# Altium schematic sheet Sheet1.SchDoc
size A2; SheetNumber: 1; SheetTotal: 1
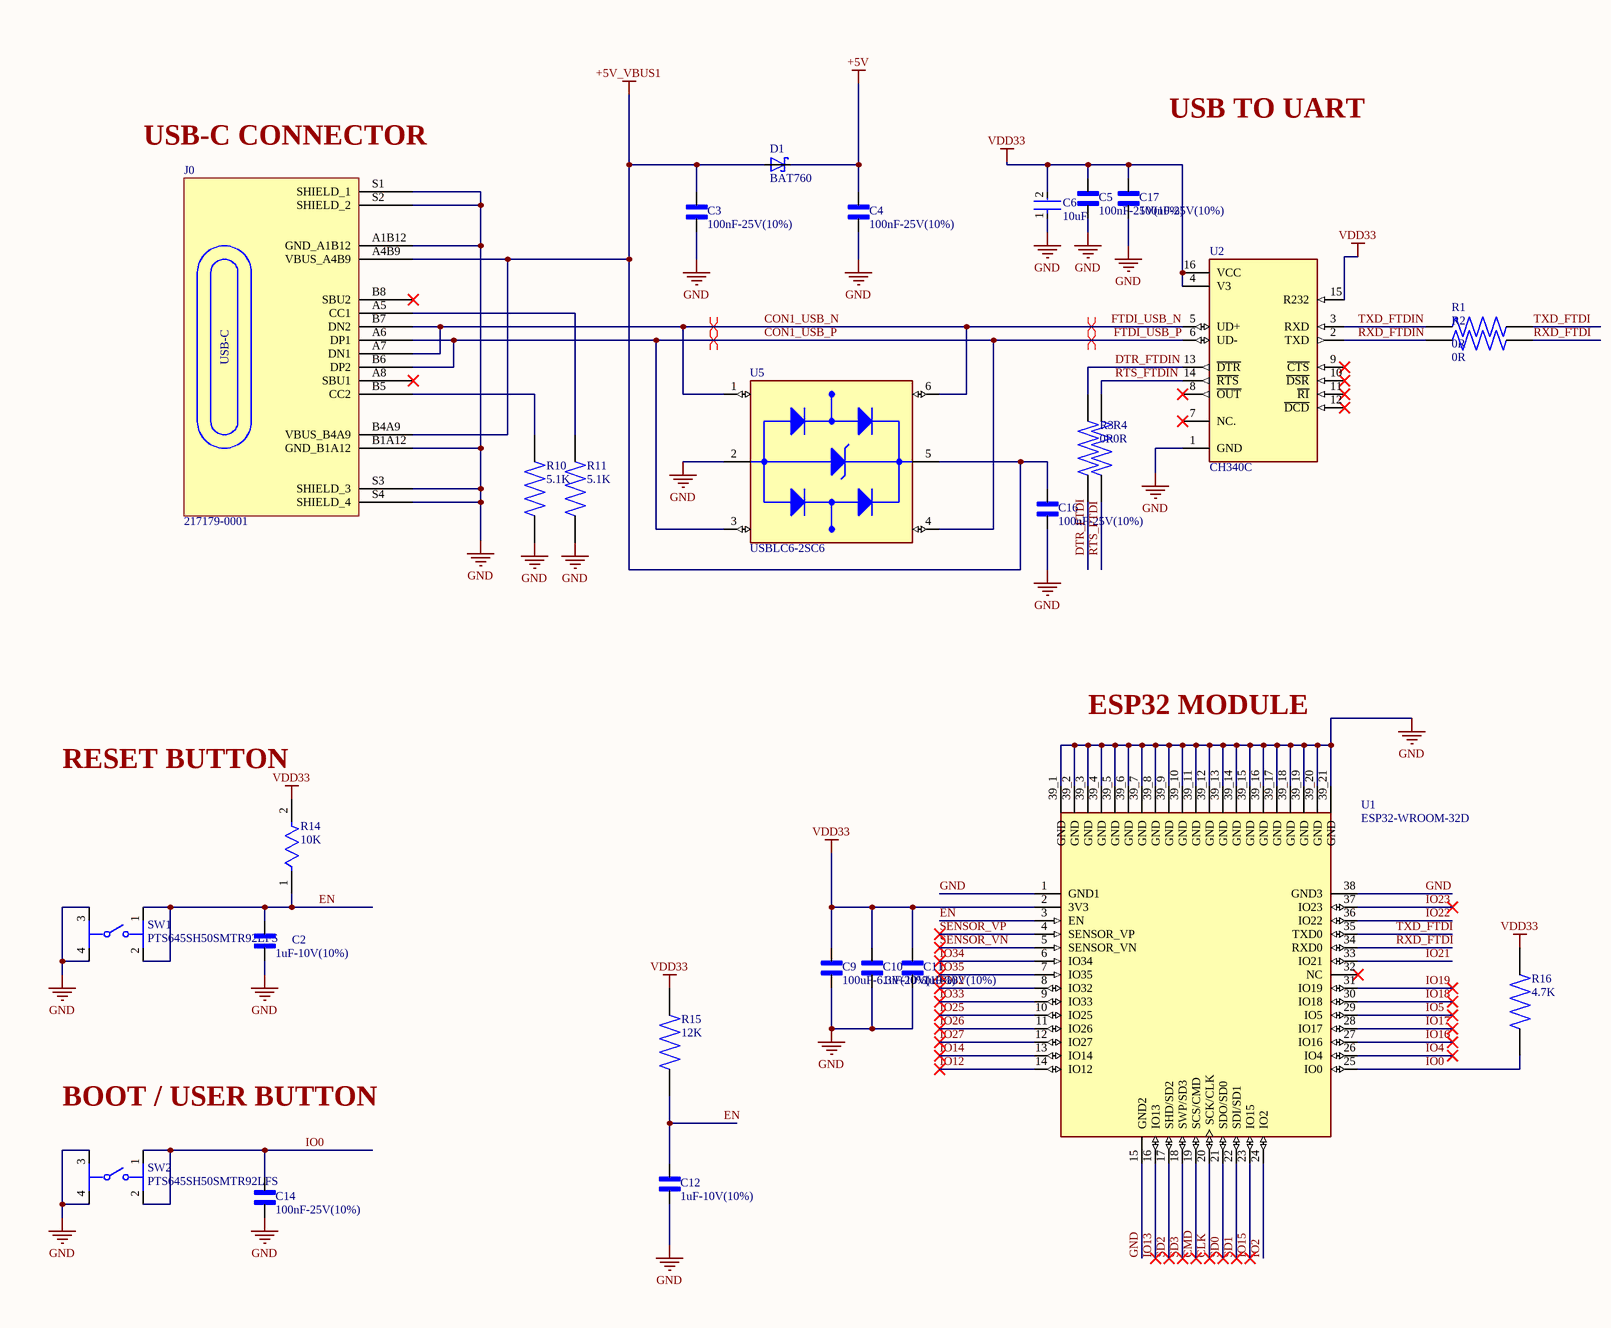
[diagram p0: Sheet1.SchDoc, left]
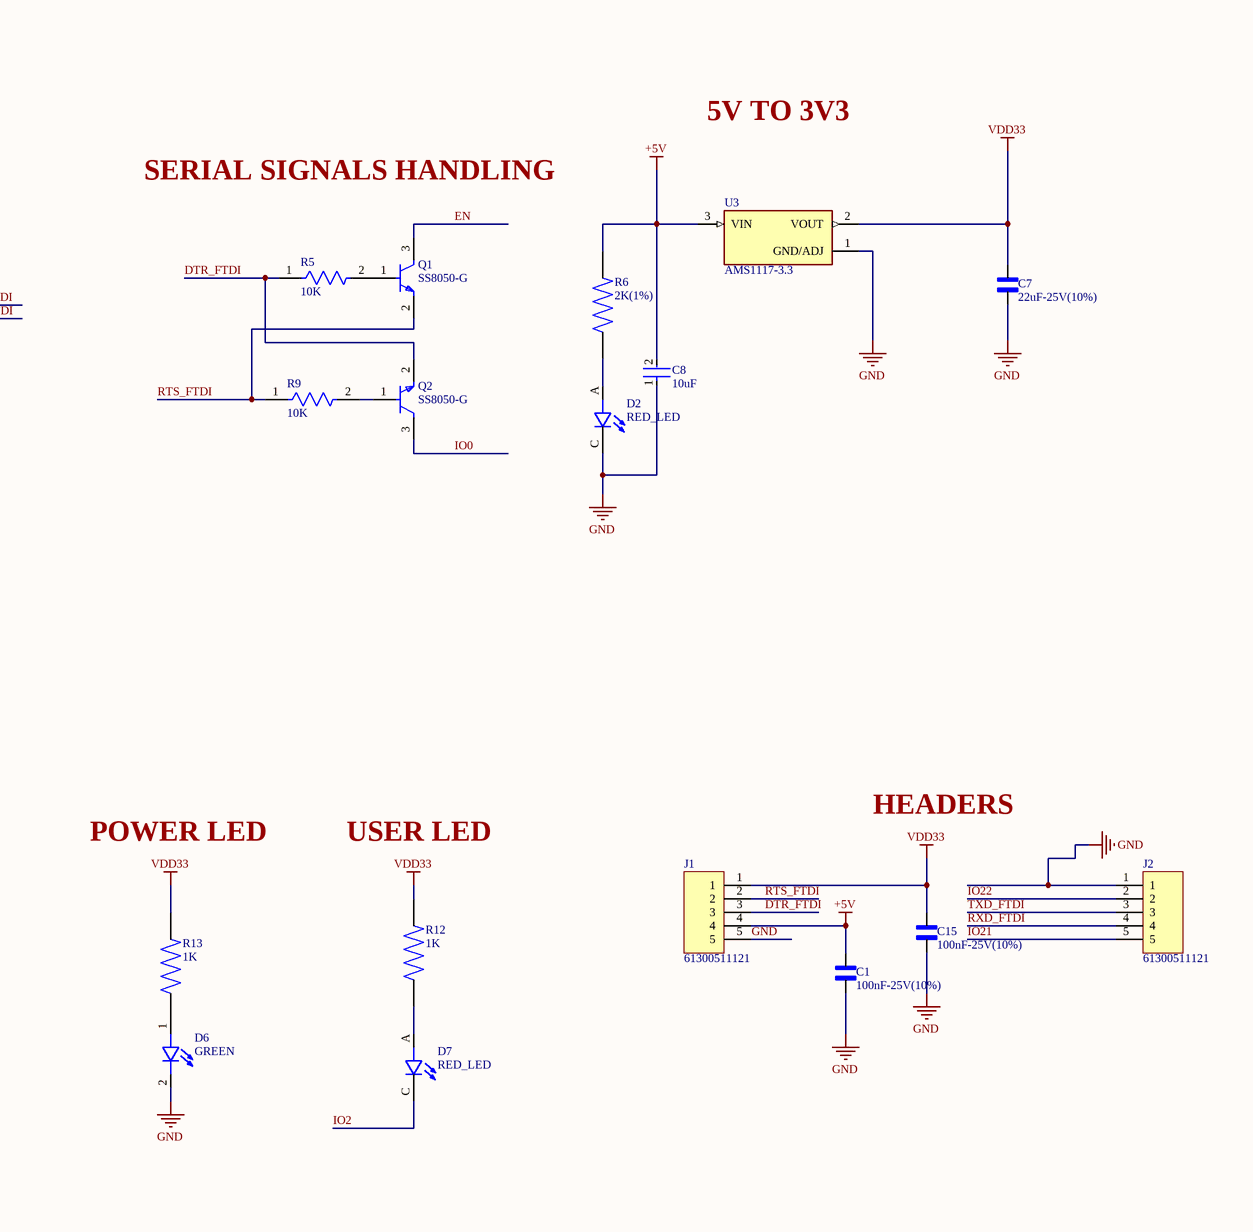
[diagram p1: Sheet1.SchDoc, right]

## Parts
C1  100nF-25V(10%)  [CAPC2012X145N - duplicate]
C2  1uF-10V(10%)  [CAPC2012X145N - duplicate]
C3  100nF-25V(10%)  [CAPC2012X145N - duplicate]
C4  100nF-25V(10%)  [CAPC2012X145N - duplicate]
C5  100nF-25V(10%)  [CAPC2012X145N - duplicate]
C6  10uF  [CAPC2012X145N - duplicate]
C7  22uF-25V(10%)  [CAPC2012X145N - duplicate]
C8  10uF  [CAPC2012X145N - duplicate]
C9  100uF-6.3V(20%)  [CAPC2012X145N - duplicate]
C10  1uF-10V(10%)  [CAPC2012X145N - duplicate]
C11  1uF-10V(10%)  [CAPC2012X145N - duplicate]
C12  1uF-10V(10%)  [CAPC2012X145N - duplicate]
C14  100nF-25V(10%)  [CAPC2012X145N - duplicate]
C15  100nF-25V(10%)  [CAPC2012X145N - duplicate]
C16  100nF-25V(10%)  [CAPC2012X145N - duplicate]
C17  100nF-25V(10%)  [CAPC2012X145N - duplicate]
D1  BAT760  [SOD323(F)]
D2  RED_LED  [LEDSC125X200X90-2N]
D6  GREEN  [LED_XZMG54W-1]
D7  RED_LED  [LEDSC125X200X90-2N]
J0  217179-0001  [FP-2171790001-MFG]
J1  61300511121  [HDR_1x5_2.54MM]
J2  61300511121  [HDR_1x5_2.54MM]
Q1  SS8050-G  [FP-SS8050-G-IPC_B]
Q2  SS8050-G  [FP-SS8050-G-IPC_B]
R1  0R  [RES_ERA6AED512V]
R2  0R  [RES_ERA6AED512V]
R3  0R  [RES_ERA6AED512V]
R4  0R  [RES_ERA6AED512V]
R5  10K  [RES_ERA6AED512V]
R6  2K(1%)  [RES_ERA6AED512V]
R9  10K  [RES_ERA6AED512V]
R10  5.1K  [RES_ERA6AED512V]
R11  5.1K  [RES_ERA6AED512V]
R12  1K  [RES_ERA6AED512V]
R13  1K  [RES_ERA6AED512V]
R14  10K  [RES_ERA6AED512V]
R15  12K  [RES_ERA6AED512V]
R16  4.7K  [RES_ERA6AED512V]
SW1  PTS645SH50SMTR92LFS  [FP-PTS645SH50SMTR92LFS-MFG]
SW2  PTS645SH50SMTR92LFS  [FP-PTS645SH50SMTR92LFS-MFG]
U1  ESP32-WROOM-32D  [MODULE_ESP32-WROOM-32D]
U2  CH340C  [SOIC127P600X180-16N]
U3  AMS1117-3.3  [SOT229P700X180-4N]
U5  USBLC6-2SC6  [SOT95P280X145-6N]

## Nets
+5V: C1.2 C4.1 C8.2 D1.1(K) J1.4 R6.2 U3.3(VIN)
+5V_VBUS1: C3.1 C16.2 D1.2(A) J0.A4B9(VBUS_A4B9) J0.B4A9(VBUS_B4A9) U5.5(VBUS)
GND: C1.1 C2.1 C3.2 C4.2 C5.1 C6.1 C7.1 C8.1 C9.1 C10.1 C11.1 C12.1 C14.1 C15.1 C16.1 C17.1 D2.C D6.2(C) J0.A1B12(GND_A1B12) J0.B1A12(GND_B1A12) J0.S1(SHIELD_1) J0.S2(SHIELD_2) J0.S3(SHIELD_3) J0.S4(SHIELD_4) J1.5 J2.1 R10.1 R11.1 SW1.3 SW1.4 SW2.3 SW2.4 U1.1(GND1) U1.15(GND2) U1.38(GND3) U1.39_1(GND) U1.39_2(GND) U1.39_3(GND) U1.39_4(GND) U1.39_5(GND) U1.39_6(GND) U1.39_7(GND) U1.39_8(GND) U1.39_9(GND) U1.39_10(GND) U1.39_11(GND) U1.39_12(GND) U1.39_13(GND) U1.39_14(GND) U1.39_15(GND) U1.39_16(GND) U1.39_17(GND) U1.39_18(GND) U1.39_19(GND) U1.39_20(GND) U1.39_21(GND) U2.1(GND) U3.1(GND/ADJ) U5.2(GND)
VDD33: C5.2 C6.2 C7.2 C9.2 C10.2 C11.2 C15.2 C17.2 J1.1 R12.2 R13.2 R14.2 R15.2 R16.2 U1.2(3V3) U2.4(V3) U2.15(R232) U2.16(VCC) U3.2(VOUT)
CLK: U1.20(SCK/CLK)
CMD: U1.19(SCS/CMD)
CON1_USB_N: J0.A7(DN1) J0.B7(DN2) U2.5(UD+) U5.1(I/O1_IN) U5.6(I/O1_OUT)  [also labelled FTDI_USB_N]
CON1_USB_P: J0.A6(DP1) J0.B6(DP2) U2.6(UD-) U5.3(I/O2_IN) U5.4(I/O2_OUT)  [also labelled FTDI_USB_P]
DTR_FTDI: J1.3 Q2.2(E) R3.1 R5.1
DTR_FTDIN: R3.2 U2.13(~{DTR})
EN: C2.2 C12.2 Q1.3(C) R14.1 R15.1 SW1.1 SW1.2 U1.3(EN)
IO0: C14.2 Q2.3(C) R16.1 SW2.1 SW2.2 U1.25(IO0)
IO2: D7.C U1.24(IO2)
IO4: U1.26(IO4)
IO5: U1.29(IO5)
IO12: U1.14(IO12)
IO13: U1.16(IO13)
IO14: U1.13(IO14)
IO15: U1.23(IO15)
IO16: U1.27(IO16)
IO17: U1.28(IO17)
IO18: U1.30(IO18)
IO19: U1.31(IO19)
IO21: J2.5 U1.33(IO21)
IO22: J2.2 U1.36(IO22)
IO23: U1.37(IO23)
IO25: U1.10(IO25)
IO26: U1.11(IO26)
IO27: U1.12(IO27)
IO32: U1.8(IO32)
IO33: U1.9(IO33)
IO34: U1.6(IO34)
IO35: U1.7(IO35)
RTS_FTDI: J1.2 Q1.2(E) R4.1 R9.1
RTS_FTDIN: R4.2 U2.14(~{RTS})
RXD_FTDI: J2.4 R2.2 U1.34(RXD0)
RXD_FTDIN: R2.1 U2.2(TXD)
SD0: U1.21(SDO/SD0)
SD1: U1.22(SDI/SD1)
SD2: U1.17(SHD/SD2)
SD3: U1.18(SWP/SD3)
SENSOR_VN: U1.5(SENSOR_VN)
SENSOR_VP: U1.4(SENSOR_VP)
TXD_FTDI: J2.3 R1.2 U1.35(TXD0)
TXD_FTDIN: R1.1 U2.3(RXD)
NetD2_A: D2.A R6.1
NetD6_1: D6.1(A) R13.1
NetD7_A: D7.A R12.1
NetJ0_A5: J0.A5(CC1) R11.2
NetJ0_B5: J0.B5(CC2) R10.2
NetQ1_1: Q1.1(B) R5.2
NetQ2_1: Q2.1(B) R9.2

Not connected (* = marked no-connect by the designer): J0 A8(SBU1)* B8(SBU2)*; U1 32(NC)*; U2 7(NC.)* 8(~{OUT})* 9(~{CTS})* 10(~{DSR})* 11(~{RI})* 12(~{DCD})*

## Layout directives
differential pair: CON1_USB_N, CON1_USB_P

## Notes on the sheet
- USB TO UART
- (near J0) USB-C CONNECTOR
- SERIAL SIGNALS HANDLING
- 5V TO 3V3
- ESP32 MODULE
- RESET BUTTON
- POWER LED
- USER LED
- HEADERS
- BOOT / USER BUTTON
- (in symbol 217179-0001) USB-C

## Library data of the parts
C1 C3-C5 C14-C17 = VJ0805Y104KXXCW1BC: Capacitor: ceramic; MLCC; 100nF; 25V; X7R; Â±10%; SMD; 0805; MF: Vishay Vitramon; SnapEDA_Link: https://www.snapeda.com/parts/VJ0805Y104KXXCW1BC/Vishay/view-part/?ref=snap; Package: 0805-2 VISHAY; Value: *; MP: VJ0805Y104KXXCW1BC; Check_prices: https://www.snapeda.com/parts/VJ0805Y104KXXCW1BC/Vishay/view-part/?ref=eda
C2 C11 C12 = C0805C105K8RACTU: MP: C0603C105K8RACTU; Package: None; Price: None; Value: *; Availability: Unavailable
C6 C8 = CMP-03020-034663-1: CAP CER 10UF 25V X5R 0805; Dissipation Factor: 10%; Dielectric Material: Ceramic; RoHS Compliant: Yes; Voltage Rating: 25V; Case Code (Metric): 2012; Case Code (Imperial): 0805; Capacitance: 10uF; Lead Free: Lead Free; Dielectric: X5R; Depth: 1.25mm; Case/Package: 0805; Height: 1.25mm; Length: 0.079inch; Termination: Solder; Thickness: 0.057inch; Tolerance: 10%; Min Operating Temperature: -55°C; Width: 0.049inch; Mount: Surface Mount; Voltage Rating (DC): 25V; REACH SVHC: No SVHC; Voltage: 25V; Packaging: Cut Tape; Max Operating Temperature: 85°C
C7 = CL31X226KAHN3NE: 22 ÂµF Â±10% 25V Ceramic Capacitor X6S 1206 (3216 Metric); MF: Samsung; SnapEDA_Link: https://www.snapeda.com/parts/CL31X226KAHN3NE/Samsung/view-part/?ref=snap; Package: SMD-2 Samsung; Value: *; MP: CL31X226KAHN3NE; Check_prices: https://www.snapeda.com/parts/CL31X226KAHN3NE/Samsung/view-part/?ref=eda
C9 = GRM21BR60J107ME15L: 100 ÂµF Â±20% 6.3V Ceramic Capacitor X5R 0805 (2012 Metric); MF: Murata; SnapEDA_Link: https://www.snapeda.com/parts/GRM21BR60J107ME15L/Murata/view-part/?ref=snap; Package: 2012 Murata; Value: *; MP: GRM21BR60J107ME15L; Check_prices: https://www.snapeda.com/parts/GRM21BR60J107ME15L/Murata/view-part/?ref=eda
C10 = C0603C105K8RACTU: Package: None; Price: None; Value: *; MP: C0603C105K8RACTU; Availability: Unavailable
D1 = BAT760: Diode Schottky 20 V 1A (DC) Surface Mount SOD-323; MF: Nexperia USA; SnapEDA_Link: https://www.snapeda.com/parts/BAT760/Nexperia/view-part/?ref=snap; Package: SOD-323 Vishay Semiconductor Diodes Division; Value: *; MP: BAT760; Check_prices: https://www.snapeda.com/parts/BAT760/Nexperia/view-part/?ref=eda
D2 D7 = 5990110007F: Red 633nm LED Indication - Discrete 2.1V 0805 (2012 Metric); MF: Dialight; MP: 599-0110-007F; Check_prices: https://www.snapeda.com/parts/599-0110-007F/Dialight/view-part/?ref=eda; Value: *; Purchase-URL: https://pricing.snapeda.com/search/part/599-0110-007F/?ref=eda; Price: None; SnapEDA_Link: https://www.snapeda.com/parts/599-0110-007F/Dialight/view-part/?ref=snap; Availability: In Stock; Package: 0805 Dialight
D6 = XZMG54W-1: Green 568nm LED Indication - Discrete 2.2V 0805 (2012 Metric); MF: SunLED; SnapEDA_Link: https://www.snapeda.com/parts/XZMG54W-1/SunLED/view-part/?ref=snap; Purchase-URL: https://pricing.snapeda.com/search/part/XZMG54W-1/?ref=eda; Price: None; Availability: In Stock; Package: None; Check_prices: https://www.snapeda.com/parts/XZMG54W-1/SunLED/view-part/?ref=eda; Value: *; MP: XZMG54W-1
J0 = 217179-0001: CONN RCP USB2.0 TYP C 24P SMD RA; Manufacturer: Molex; Supplier: Digikey; Supplier Part Number: 900-2171790001CT-ND; Manufacturer Part Number: 217179-0001; RoHS: No; Category: Connectors; Stock: 7228; Pricing: 1=0.9, 10=0.745, 100=0.6212 (USD); LCSC Part Number: C3197684
J1 J2 = 61300511121: WR-PHD Straight Male, PCB Header, Through Hole, 1 Rows, 5 Contacts, 2.54mm Pitch; Manufacturer: Wurth Elektronik; Connector Type: Male Pin; Contact Resistance: 20mΩ; Current Rating: 3A; Insulation Resistance: 1GΩ; Number of Contacts: 5; Operating Supply Voltage: 250V; Supplier: DigiKey; Supplier Part Number: 732-5318-ND; Manufacturer Part Number: 61300511121; RoHS: Compliant; Category: Headers and Wire Housings; Stock: 28102; Pricing: 1=0.26, 10=0.222, 25=0.1852, 50=0.155, 100=0.141, 1000=0.13485 (USD); Color: Black; Contact Material: Gold; Contact Mating Length: 5.9944mm; Contact Plating: Gold; Gender: Male; Height: 8.89mm; Lead Free: Lead Free; Lead Pitch: 2.54mm; Length: 12.7mm; Max Operating Temperature: 105°C; Min Operating Temperature: -40°C; Mounting Technology: Through Hole; Pins: 5; Number of Positions: 5; Number of Rows: 1; Orientation: Vertical; Packaging: Bulk; Pitch: 2.54mm; Termination: Solder; Voltage Rating: 250V; ComponentLink1URL: https://datasheet.octopart.com:443/61300511121-W%C3%BCrth-Elektronik-datasheet-44382959.pdf?src-supplier=Future+Electronics; ComponentLink1Description: https://datasheet.octopart.com:443/61300511121-W%C3%BCrth-Elektronik-datasheet-44382959.pdf?src-supplier=Future+Electronics; ComponentLink2URL: https://datasheet.octopart.com:443/61300511121-Wurth-Elektronik-datasheet-190366221.pdf?src-supplier=Wurth+Elektronik; ComponentLink2Description: https://datasheet.octopart.com:443/61300511121-Wurth-Elektronik-datasheet-190366221.pdf?src-supplier=Wurth+Elektronik; ComponentLink3URL: https://datasheet.octopart.com:443/61300511121-W%C3%BCrth-Elektronik-datasheet-149524068.pdf?src-supplier=Farnell; ComponentLink3Description: https://datasheet.octopart.com:443/61300511121-W%C3%BCrth-Elektronik-datasheet-149524068.pdf?src-supplier=Farnell; ComponentLink4URL: https://datasheet.octopart.com:443/61300511121-W%C3%BCrth-Elektronik-datasheet-21154836.pdf?src-supplier=element14+APAC; ComponentLink4Description: https://datasheet.octopart.com:443/61300511121-W%C3%BCrth-Elektronik-datasheet-21154836.pdf?src-supplier=element14+APAC
Q1 Q2 = SS8050-G: TRANS NPN 25V 1.5A SOT23-3; Manufacturer: Comchip; Supplier: Digikey; Supplier Part Number: 641-1790-1-ND; Manufacturer Part Number: SS8050-G; RoHS: Yes; Category: Transistors; Stock: 108568; Pricing: 1=0.29, 10=0.2, 100=0.0978, 500=0.08154, 1000=0.05666 (USD); Reach SVHC Compliant: Yes; RoHS Compliant: Yes; ComponentLink1URL: https://datasheet.ciiva.com:443/pdfs/VipMasterIC/IC/COMC/COMC-S-A0004994192/COMC-S-A0004994192-1.pdf?src-supplier=IHS+Markit; ComponentLink1Description: https://datasheet.ciiva.com:443/pdfs/VipMasterIC/IC/COMC/COMC-S-A0004994192/COMC-S-A0004994192-1.pdf?src-supplier=IHS+Markit; ComponentLink2URL: http://www.comchiptech.com/admin/files/product/SS8050-G RevA181526.pdf?src-supplier=Digikey; ComponentLink2Description: http://www.comchiptech.com/admin/files/product/SS8050-G RevA181526.pdf?src-supplier=Digikey; LCSC Part Number: C164886
R1-R4 = CR0805AJ/-000EAS: Resistor, AS 0805 0R Jumper 125mW, AEC-Q, Anti-Sulfur | Bourns CR0805AJ/-000EAS; SnapEDA_Link: https://www.snapeda.com/parts/CR0805AJ/-000EAS/Bourns/view-part/?ref=snap; Package: 0805 Bourns; Value: *; MF: Bourns; MP: CR0805AJ/-000EAS; Check_prices: https://www.snapeda.com/parts/CR0805AJ/-000EAS/Bourns/view-part/?ref=eda
R5 R9 R14 = CMP-03412-049031-1: Thin Film Chip Resistors Automotive Grade 10kΩ 0.5% 50ppm/°C 0805; Max Power Dissipation: 125mW; Resistance: 10kR; Ratings: AEC-Q200; Length: 0.079inch; Temperature Coefficient: 50ppm/°C; Height: 0.024inch; Min Operating Temperature: -55°C; Case/Package: 0805; Tolerance: 0.5%; RoHS Compliant: Yes; Features: Moisture Resistant; Number of Terminations: 2; Max Operating Temperature: 155°C; Series: AT; Packaging: Tape and Reel; Width: 0.049inch; Resistor Type: Thin Film
R6 = CR0805-FX-2001ELF: Res 0805 2k 1% 125mW | Bourns CR0805-FX-2001ELF; SnapEDA_Link: https://www.snapeda.com/parts/CR0805-FX-2001ELF/Bourns/view-part/?ref=snap; Package: 0805 Bourns; Value: *; MF: Bourns; MP: CR0805-FX-2001ELF; Check_prices: https://www.snapeda.com/parts/CR0805-FX-2001ELF/Bourns/view-part/?ref=eda
R10 R11 = ERA6AED512V: Res Thin Film 0805 5.1K Ohm 0.5% 0.125W(1/8W) Â±25ppm/Â°C Pad SMD Automotive T/R; MF: Panasonic; Check_prices: https://www.snapeda.com/parts/ERA6AED512V/Panasonic/view-part/5775663/?ref=eda; Package: 2012-2 Panasonic; SnapEDA_Link: https://www.snapeda.com/parts/ERA6AED512V/Panasonic/view-part/5775663/?ref=snap; Digi-Key_Part_Number: P123856CT-ND; MP: ERA6AED512V; Value: *
R12 R13 = CRS0805-JX-102ELF: 1 kOhms Â±5% 0.25W, 1/4W Chip Resistor 0805 (2012 Metric) High Voltage, Pulse Withstanding Thick Film; MF: Bourns; MP: CRS0805-JX-102ELF; SnapEDA_Link: https://www.snapeda.com/parts/CRS0805-JX-102ELF/Bourns/view-part/?ref=snap; Availability: In Stock; Package: 2012 Stackpole; Check_prices: https://www.snapeda.com/parts/CRS0805-JX-102ELF/Bourns/view-part/?ref=eda; Value: *; Purchase-URL: https://pricing.snapeda.com/search/part/CRS0805-JX-102ELF/?ref=eda; Price: None
R15 = ERJU06F1202V: Res Thkflm Anti-Sulfur 0805 12k Ohm 1%, Ag Pd Based Smd; MF: Panasonic; MP: ERJ-U06F1202V; SnapEDA_Link: https://www.snapeda.com/parts/ERJ-U06F1202V/Panasonic/view-part/?ref=snap; Package: 2012-2 Panasonic; Value: *; Check_prices: https://www.snapeda.com/parts/ERJ-U06F1202V/Panasonic/view-part/?ref=eda
R16 = CR0805-FX-4701ELF: Res Thick Film 0805 4.7K Ohm 1% 0.125W(1/8W) ?100ppm/C Molded SMD T/R <a href="https://pricing.snapeda.com/parts/CR0805-FX-4701ELF/Bourns/view-part?ref=eda">Check availability</a> <a href="https://pricing.snapeda.com/parts/CR0805-FX-4701ELF/Bourns/view-part?ref=eda">Check availability</a>; MF: {'manufacturer': u'Bourns Inc.'}; Package: None; Price: None; Value: *; MP: CR0805-FX-4701ELF; Availability: Unavailable
SW1 SW2 = PTS645SH50SMTR92LFS: SWITCH TACTILE SPST-NO 0.05A 12V; Manufacturer: ITT C&K; Manufacturer Series: PTS645; Actuator Type: Pushbutton; Contact Current(DC)-Max: 50mA; Contact DC Max Rating R Load: 0.05A@12VDC; Contact Resistance: 0.1mR; Dielectric Withstand Volts: 250VACV; Electrical Life: 100000Cycles; Insulation Resistance: 100GR; PCB Hole Count: 4; Switch Action: MOMENTARY; Switch Function: SPST; Switch Type: Keypad; Body Breadth: 5.9944inch; Body Height: 3.4544mm; Body Length or Diameter: 5.9944mm; Supplier: Digikey; Supplier Part Number: CKN9085CT-ND; Manufacturer Part Number: PTS645SH50SMTR92LFS; RoHS: Yes; Category: Tactile Switches; Stock: 64637; Pricing: 1=0.35, 10=0.337, 25=0.3172, 100=0.2753, 250=0.24972, 500=0.2323 (USD); Mounting Technology: Surface Mount; Terminal Finish: Silver; Min Operating Temperature: -20°C; Max Operating Temperature: 60°C; JESD-609 Code: e4; Contact Voltage(DC)-Max: 12V; Termination: Solder; Terminal Length: 0.138inch; Reach SVHC Compliant: Yes; RoHS Compliant: Yes; ComponentLink1URL: https://datasheet.ciiva.com:443/pdfs/VipMasterIC/IC/CKCI/CKCI-S-A0001796527/CKCI-S-A0001796842-1.pdf?src-supplier=IHS+Markit; ComponentLink1Description: https://datasheet.ciiva.com:443/pdfs/VipMasterIC/IC/CKCI/CKCI-S-A0001796527/CKCI-S-A0001796842-1.pdf?src-supplier=IHS+Markit; ComponentLink2URL: https://datasheet.ciiva.com/29903/getdatasheetpartid-773702-29903807.pdf?src-supplier=Verical; ComponentLink2Description: https://datasheet.ciiva.com/29903/getdatasheetpartid-773702-29903807.pdf?src-supplier=Verical; ComponentLink3URL: https://datasheet.ciiva.com/14920/pts645-14920741.pdf?src-supplier=Digikey; ComponentLink3Description: https://datasheet.ciiva.com/14920/pts645-14920741.pdf?src-supplier=Digikey; ComponentLink4URL: https://datasheet.ciiva.com/22637/1707731-22637356.pdf?src-supplier=Element14; ComponentLink4Description: https://datasheet.ciiva.com/22637/1707731-22637356.pdf?src-supplier=Element14; LCSC Part Number: C221869
U1 = ESP32-WROOM-32D: Bluetooth, WiFi 802.11b/g/n, Bluetooth v4.2 +EDR, Class 1, 2 and 3 Transceiver Module 2.4GHz ~ 2.5GHz Integrated; MF: Espressif Systems; SnapEDA_Link: https://www.snapeda.com/parts/ESP32-WROOM-32D/Espressif+Systems/view-part/?ref=snap; Package: Non Standard Espressif Systems; Value: *; MP: ESP32-WROOM-32D; Check_prices: https://www.snapeda.com/parts/ESP32-WROOM-32D/Espressif+Systems/view-part/?ref=eda
U2 = CH340C: USB to serial chip CH340; MF: WCH; Price: None; Availability: Not in stock; MP: CH340C; Package: None; SnapEDA_Link: https://www.snapeda.com/parts/CH340C/WCH/view-part/?ref=snap; Check_prices: https://www.snapeda.com/parts/CH340C/WCH/view-part/?ref=eda; Value: *
U3 = AMS1117-3.3: Sot223/Pkg 1-Amp 3.3-Volt Low Drop Out Voltage Regulatator; MF: Advanced Monolithic Systems; SnapEDA_Link: https://www.snapeda.com/parts/AMS1117-3.3/Advanced+Monolithic+Systems/view-part/?ref=snap; Package: SOT-223 Seeed Technology; Value: *; MP: AMS1117-3.3; Check_prices: https://www.snapeda.com/parts/AMS1117-3.3/Advanced+Monolithic+Systems/view-part/?ref=eda
U5 = USBLC6-2SC6: 17V Clamp 5A (8/20Âµs) Ipp Tvs Diode Surface Mount SOT-23-6; MF: STMicroelectronics; Value: *; SnapEDA_Link: https://www.snapeda.com/parts/USBLC6-2SC6/STMicroelectronics/view-part/?ref=snap; Check_prices: https://www.snapeda.com/parts/USBLC6-2SC6/STMicroelectronics/view-part/?ref=eda; Purchase-URL: https://pricing.snapeda.com/search/part/USBLC6-2SC6/?ref=eda; Price: None; Availability: In Stock; Package: SOT-23-6 STMicroelectronics; MP: USBLC6-2SC6